# Altium schematic sheet SolarCharger.SchDoc
size A2
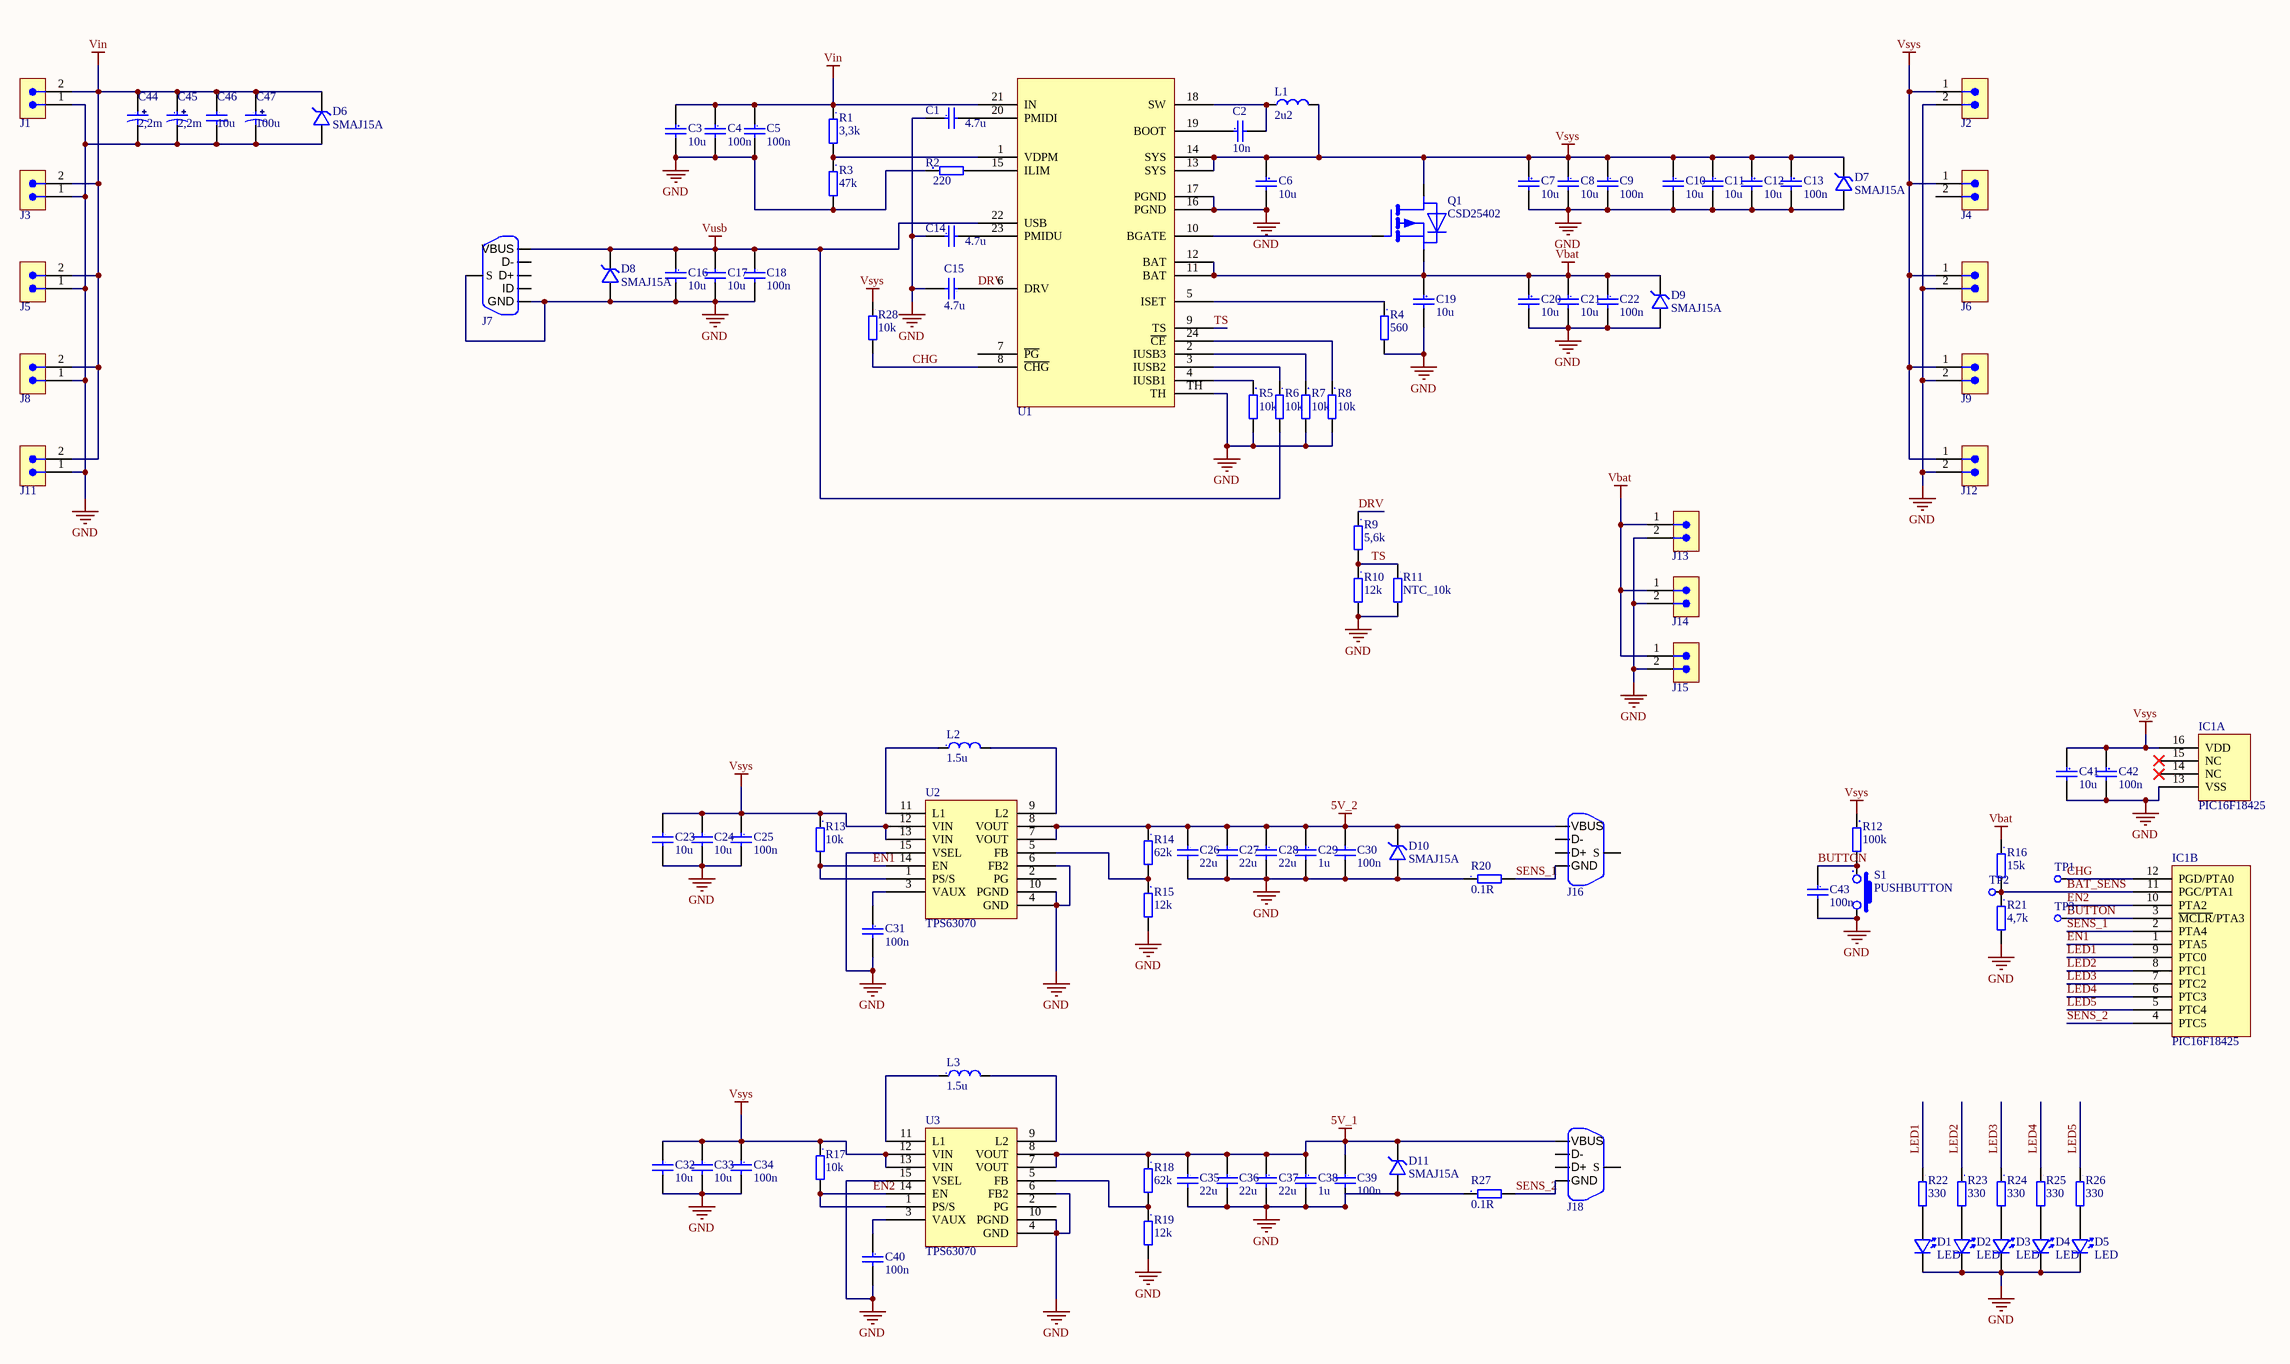
[diagram p0: SolarCharger.SchDoc]

## Parts
C1  4.7u  [C0603_N]
C2  10n  [C0603_N]
C3  10u  [C0805_N]
C4  100n  [C0603_N]
C5  100n  [C0603_N]
C6  10u  [C0805_N]
C7  10u  [C0805_N]
C8  10u  [C0805_N]
C9  100n  [C0603_N]
C10  10u  [C0805_N]
C11  10u  [C0805_N]
C12  10u  [C0805_N]
C13  100n  [C0603_N]
C14  4.7u  [C0603_N]
C15  4.7u  [C0603_N]
C16  10u  [C0805_N]
C17  10u  [C0805_N]
C18  100n  [C0603_N]
C19  10u  [C0805_N]
C20  10u  [C0805_N]
C21  10u  [C0805_N]
C22  100n  [C0603_N]
C23  10u  [C0603_N]
C24  10u  [C0805_N]
C25  100n  [C0603_N]
C26  22u  [C0805_N]
C27  22u  [C0805_N]
C28  22u  [C0805_N]
C29  1u  [C0603_N]
C30  100n  [C0603_N]
C31  100n  [C0402_N]
C32  10u  [C0603_N]
C33  10u  [C0805_N]
C34  100n  [C0603_N]
C35  22u  [C0805_N]
C36  22u  [C0805_N]
C37  22u  [C0805_N]
C38  1u  [C0603_N]
C39  100n  [C0603_N]
C40  100n  [C0402_N]
C41  10u  [C0805_N]
C42  100n  [C0603_N]
C43  100n  [C0402_N]
C44  2,2m  [C592D_X]
C45  2,2m  [C592D_X]
C46  10u  [C0805_N]
C47  100u  [C_TR3D]
D1  LED  [LED_0603]
D2  LED  [LED_0603]
D3  LED  [LED_0603]
D4  LED  [LED_0603]
D5  LED  [LED_0603]
D6  SMAJ15A  [DO-214AC]
D7  SMAJ15A  [DO-214AC]
D8  SMAJ15A  [DO-214AC]
D9  SMAJ15A  [DO-214AC]
D10  SMAJ15A  [DO-214AC]
D11  SMAJ15A  [DO-214AC]
IC1  PIC16F18425  [UQFN-16]  (parts A,B of 2)
J1  (no value)  [B2B-XH-A]
J2  (no value)  [B2B-XH-A]
J3  (no value)  [B2B-XH-A]
J4  (no value)  [B2B-XH-A]
J5  (no value)  [B2B-XH-A]
J6  (no value)  [B2B-XH-A]
J7  USB_OTG  [WR-COM-629105136821]  (value not drawn)
J8  (no value)  [B2B-XH-A]
J9  (no value)  [B2B-XH-A]
J11  (no value)  [B2B-XH-A]
J12  (no value)  [B2B-XH-A]
J13  (no value)  [B2B-XH-A]
J14  (no value)  [B2B-XH-A]
J15  (no value)  [B2B-XH-A]
J16  USB  [USB_TYPE_A_SOCK]  (value not drawn)
J18  USB  [USB_TYPE_A_SOCK]  (value not drawn)
L1  2u2  [SNR5040]
L2  1.5u  [IHLP2020]
L3  1.5u  [IHLP2020]
Q1  CSD25402  [DNH8]
R1  3,3k  [R0603_N]
R2  220  [R0603_N]
R3  47k  [R0603_N]
R4  560  [R0603_N]
R5  10k  [R0603_N]
R6  10k  [R0603_N]
R7  10k  [R0603_N]
R8  10k  [R0603_N]
R9  5,6k  [R0603_N]
R10  12k  [R0603_N]
R11  NTC_10k  [R0603_N]
R12  100k  [R0402_N]
R13  10k  [R0402_N]
R14  62k  [R0603_N]
R15  12k  [R0603_N]
R16  15k  [R0603_N]
R17  10k  [R0402_N]
R18  62k  [R0603_N]
R19  12k  [R0603_N]
R20  0.1R  [R0805_N]
R21  4,7k  [R0603_N]
R22  330  [R0402_N]
R23  330  [R0402_N]
R24  330  [R0402_N]
R25  330  [R0402_N]
R26  330  [R0402_N]
R27  0.1R  [R0805_N]
R28  10k  [R0402_N]
S1  PUSHBUTTON  [TACT6X6_SMD]
TP1  TP  [TP_1MM]  (value not drawn)  (no BOM)
TP2  TP  [TP_1MM]  (value not drawn)  (no BOM)
TP3  TP  [TP_1MM]  (value not drawn)  (no BOM)
U1  BQ24166  [VQFN-24]  (value not drawn)
U2  TPS63070  [TPS63070]
U3  TPS63070  [TPS63070]

## Nets
5V_1: C35.1 C36.1 C37.1 C38.1 C39.1 D11.C J18.VBUS R18.1 U3.7(VOUT) U3.8(VOUT)
5V_2: C26.1 C27.1 C28.1 C29.1 C30.1 D10.C J16.VBUS R14.1 U2.7(VOUT) U2.8(VOUT)
GND: C1.1 C3.2 C4.2 C5.2 C6.2 C7.2 C8.2 C9.2 C10.2 C11.2 C12.2 C13.2 C14.1 C15.2 C16.2 C17.2 C18.2 C19.2 C20.2 C21.2 C22.2 C23.2 C24.2 C25.2 C26.2 C27.2 C28.2 C29.2 C30.2 C31.2 C32.2 C33.2 C34.2 C35.2 C36.2 C37.2 C38.2 C39.2 C40.2 C41.2 C42.2 C43.2 C44.N C45.N C46.2 C47.N D1.K D2.K D3.K D4.K D5.K D6.A D7.A D8.A D9.A D10.A D11.A IC1.13(VSS) J1.1 J2.2 J3.1 J5.1 J6.2 J7.GND J7.S J8.1 J9.2 J11.1 J12.2 J13.2 J14.2 J15.2 R2.1 R3.2 R4.2 R5.2 R7.2 R8.2 R10.2 R11.2 R15.2 R19.2 R20.1 R21.2 R27.1 S1.2 U1.16(PGND) U1.17(PGND) U1.TH U2.4(GND) U2.6(FB2) U2.10(PGND) U2.15(VSEL) U3.4(GND) U3.6(FB2) U3.10(PGND) U3.15(VSEL)
Vbat: C19.1 C20.1 C21.1 C22.1 D9.C J13.1 J14.1 J15.1 Q1.S R16.1 U1.11(BAT) U1.12(BAT)
Vin: C3.1 C4.1 C5.1 C44.P C45.P C46.1 C47.P D6.C J1.2 J3.2 J5.2 J8.2 J11.2 R1.1 U1.21(IN)
Vsys: C6.1 C7.1 C8.1 C9.1 C10.1 C11.1 C12.1 C13.1 C23.1 C24.1 C25.1 C32.1 C33.1 C34.1 C41.1 C42.1 D7.C IC1.16(VDD) J2.1 J4.1 J6.1 J9.1 J12.1 L1.2 Q1.D R12.1 R13.1 R17.1 R28.1 U1.13(SYS) U1.14(SYS) U2.12(VIN) U2.13(VIN) U3.12(VIN) U3.13(VIN)
Vusb: C16.1 C17.1 C18.1 D8.C J7.VBUS R6.2 U1.22(USB)
BAT_SENS: IC1.11(PGC/PTA1) R16.2 R21.1 TP2.1
BUTTON: C43.1 IC1.3(~{MCLR}/PTA3) R12.2 S1.1 TP3.1
CHG: IC1.12(PGD/PTA0) R28.2 TP1.1 U1.8(~{CHG})
DRV: C15.1 R9.1 U1.6(DRV)
EN1: IC1.1(PTA5) R13.2 U2.1(PS/S) U2.14(EN)
EN2: IC1.10(PTA2) R17.2 U3.1(PS/S) U3.14(EN)
LED1: IC1.9(PTC0) R22.1
LED2: IC1.8(PTC1) R23.1
LED3: IC1.7(PTC2) R24.1
LED4: IC1.6(PTC3) R25.1
LED5: IC1.5(PTC4) R26.1
SENS_1: IC1.2(PTA4) J16.GND R20.2
SENS_2: IC1.4(PTC5) J18.GND R27.2
TS: R9.2 R10.1 R11.1 U1.9(TS)
NetC1_2: C1.2 U1.20(PMIDI)
NetC2_1: C2.1 U1.19(BOOT)
NetC2_2: C2.2 L1.1 U1.18(SW)
NetC14_2: C14.2 U1.23(PMIDU)
NetC31_1: C31.1 U2.3(VAUX)
NetC40_1: C40.1 U3.3(VAUX)
NetD1_A: D1.A R22.2
NetD2_A: D2.A R23.2
NetD3_A: D3.A R24.2
NetD4_A: D4.A R25.2
NetD5_A: D5.A R26.2
NetL2_1: L2.1 U2.11(L1)
NetL2_2: L2.2 U2.9(L2)
NetL3_1: L3.1 U3.11(L1)
NetL3_2: L3.2 U3.9(L2)
NetQ1_G: Q1.G U1.10(BGATE)
NetR1_2: R1.2 R3.1 U1.1(VDPM)
NetR2_2: R2.2 U1.15(ILIM)
NetR4_1: R4.1 U1.5(ISET)
NetR5_1: R5.1 U1.4(IUSB1)
NetR6_1: R6.1 U1.3(IUSB2)
NetR7_1: R7.1 U1.2(IUSB3)
NetR8_1: R8.1 U1.24(~{CE})
NetR14_2: R14.2 R15.1 U2.5(FB)
NetR18_2: R18.2 R19.1 U3.5(FB)

Not connected (* = marked no-connect by the designer): IC1 14(NC)* 15(NC)*; J4 2; J7 D_N(D-) D_P(D+) ID; J16 D_N(D-) D_P(D+) S; J18 D_N(D-) D_P(D+) S; U1 7(~{PG}); U2 2(PG); U3 2(PG)

## Library data of the parts
C1-C43 C46 = CAP: RevS: $Rev:: 58        $
C44 C45 C47 = CAP_POL: RevS: $Rev:: 58        $
D6-D11 = DIODE_ZENER
IC1 = PIC16F18425: PIC16F18425 chip with 16 pin lead
J1-J6 J8 J9 J11-J15 = PINHDR_2X1: Socket; ComponentLink1Description: Manufacturer; ComponentLink1URL: http://www.we-online.de; ComponentLink2Description: Datasheet; ComponentLink2URL: http://katalog.we-online.de/em/datasheet/691412320002.pdf
J7 = USB_OTG: USB Connector, With Pegs, Micro USB Type B, USB 2.0, Receptacle, 5 Ways, Surface Mount, Right Angle
J16 J18 = USB: USB Connector, With Pegs, Micro USB Type B, USB 2.0, Receptacle, 5 Ways, Surface Mount, Right Angle
L1-L3 = IND: Inductor
Q1 = MOSFET_P
R1-R28 = RES
U1 = BQ24166: 2.5A, Dual-Input, Single Cell Switch Mode Li-Ion Battery Charger with Power Path / Management
U2 U3 = TPS63070: 2-V to 16-V Buck-Boost Converter With 3.6-A Switch Current